# EAGLE design WIXIE (EAGLE 9.6.2)
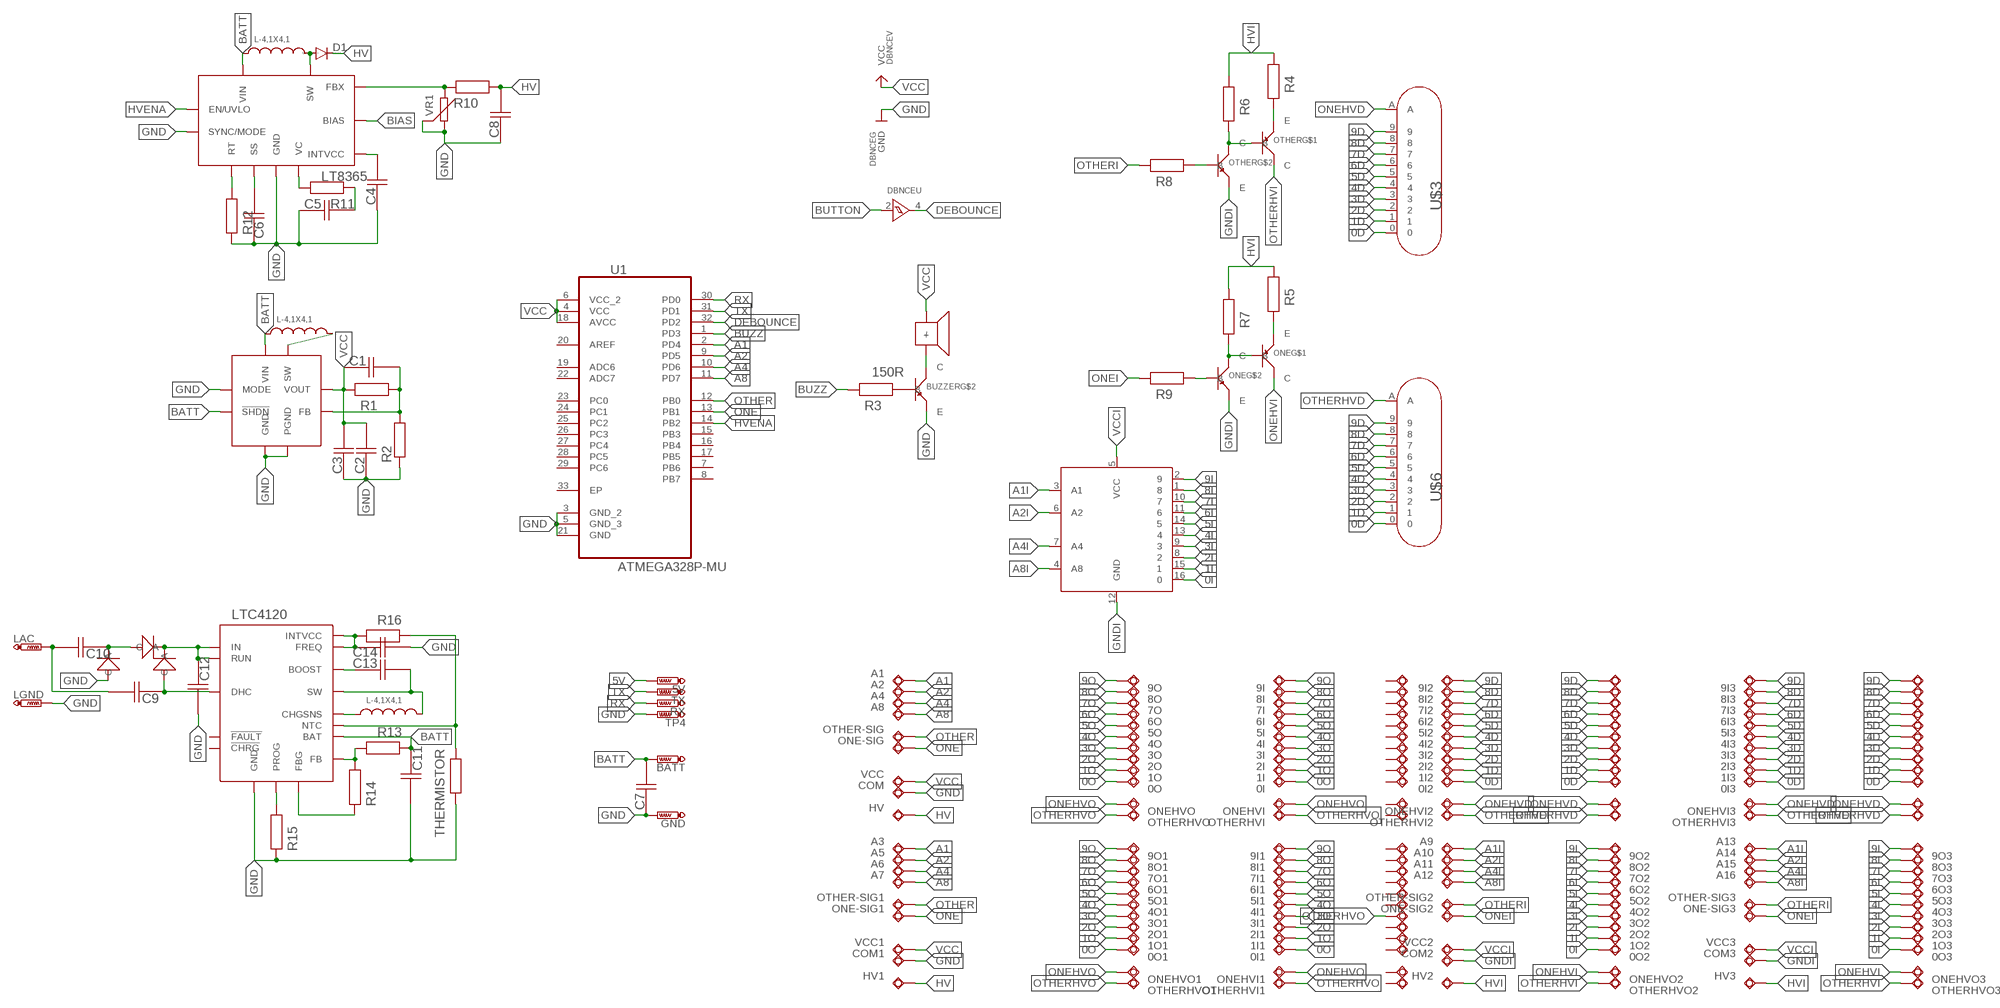
[diagram p0: schematic, sheet 1]

## Parts
0I  TPSQTP12SQ  [TP12SQ]
0I1  TPSQTP12SQ  [TP12SQ]
0I2  TPSQTP12SQ  [TP12SQ]
0I3  TPSQTP12SQ  [TP12SQ]
0O  TPSQTP12SQ  [TP12SQ]
0O1  TPSQTP12SQ  [TP12SQ]
0O2  TPSQTP12SQ  [TP12SQ]
0O3  TPSQTP12SQ  [TP12SQ]
1I  TPSQTP12SQ  [TP12SQ]
1I1  TPSQTP12SQ  [TP12SQ]
1I2  TPSQTP12SQ  [TP12SQ]
1I3  TPSQTP12SQ  [TP12SQ]
1O  TPSQTP12SQ  [TP12SQ]
1O1  TPSQTP12SQ  [TP12SQ]
1O2  TPSQTP12SQ  [TP12SQ]
1O3  TPSQTP12SQ  [TP12SQ]
2I  TPSQTP12SQ  [TP12SQ]
2I1  TPSQTP12SQ  [TP12SQ]
2I2  TPSQTP12SQ  [TP12SQ]
2I3  TPSQTP12SQ  [TP12SQ]
2O  TPSQTP12SQ  [TP12SQ]
2O1  TPSQTP12SQ  [TP12SQ]
2O2  TPSQTP12SQ  [TP12SQ]
2O3  TPSQTP12SQ  [TP12SQ]
3I  TPSQTP12SQ  [TP12SQ]
3I1  TPSQTP12SQ  [TP12SQ]
3I2  TPSQTP12SQ  [TP12SQ]
3I3  TPSQTP12SQ  [TP12SQ]
3O  TPSQTP12SQ  [TP12SQ]
3O1  TPSQTP12SQ  [TP12SQ]
3O2  TPSQTP12SQ  [TP12SQ]
3O3  TPSQTP12SQ  [TP12SQ]
4I  TPSQTP12SQ  [TP12SQ]
4I1  TPSQTP12SQ  [TP12SQ]
4I2  TPSQTP12SQ  [TP12SQ]
4I3  TPSQTP12SQ  [TP12SQ]
4O  TPSQTP12SQ  [TP12SQ]
4O1  TPSQTP12SQ  [TP12SQ]
4O2  TPSQTP12SQ  [TP12SQ]
4O3  TPSQTP12SQ  [TP12SQ]
5I  TPSQTP12SQ  [TP12SQ]
5I1  TPSQTP12SQ  [TP12SQ]
5I2  TPSQTP12SQ  [TP12SQ]
5I3  TPSQTP12SQ  [TP12SQ]
5O  TPSQTP12SQ  [TP12SQ]
5O1  TPSQTP12SQ  [TP12SQ]
5O2  TPSQTP12SQ  [TP12SQ]
5O3  TPSQTP12SQ  [TP12SQ]
5V  PTR1B1,27  [B1,27]
6I  TPSQTP12SQ  [TP12SQ]
6I1  TPSQTP12SQ  [TP12SQ]
6I2  TPSQTP12SQ  [TP12SQ]
6I3  TPSQTP12SQ  [TP12SQ]
6O  TPSQTP12SQ  [TP12SQ]
6O1  TPSQTP12SQ  [TP12SQ]
6O2  TPSQTP12SQ  [TP12SQ]
6O3  TPSQTP12SQ  [TP12SQ]
7I  TPSQTP12SQ  [TP12SQ]
7I1  TPSQTP12SQ  [TP12SQ]
7I2  TPSQTP12SQ  [TP12SQ]
7I3  TPSQTP12SQ  [TP12SQ]
7O  TPSQTP12SQ  [TP12SQ]
7O1  TPSQTP12SQ  [TP12SQ]
7O2  TPSQTP12SQ  [TP12SQ]
7O3  TPSQTP12SQ  [TP12SQ]
8I  TPSQTP12SQ  [TP12SQ]
8I1  TPSQTP12SQ  [TP12SQ]
8I2  TPSQTP12SQ  [TP12SQ]
8I3  TPSQTP12SQ  [TP12SQ]
8O  TPSQTP12SQ  [TP12SQ]
8O1  TPSQTP12SQ  [TP12SQ]
8O2  TPSQTP12SQ  [TP12SQ]
8O3  TPSQTP12SQ  [TP12SQ]
9I  TPSQTP12SQ  [TP12SQ]
9I1  TPSQTP12SQ  [TP12SQ]
9I2  TPSQTP12SQ  [TP12SQ]
9I3  TPSQTP12SQ  [TP12SQ]
9O  TPSQTP12SQ  [TP12SQ]
9O1  TPSQTP12SQ  [TP12SQ]
9O2  TPSQTP12SQ  [TP12SQ]
9O3  TPSQTP12SQ  [TP12SQ]
A1  TPSQTP12SQ  [TP12SQ]
A2  TPSQTP12SQ  [TP12SQ]
A3  TPSQTP12SQ  [TP12SQ]
A4  TPSQTP12SQ  [TP12SQ]
A5  TPSQTP12SQ  [TP12SQ]
A6  TPSQTP12SQ  [TP12SQ]
A7  TPSQTP12SQ  [TP12SQ]
A8  TPSQTP12SQ  [TP12SQ]
A9  TPSQTP12SQ  [TP12SQ]
A10  TPSQTP12SQ  [TP12SQ]
A11  TPSQTP12SQ  [TP12SQ]
A12  TPSQTP12SQ  [TP12SQ]
A13  TPSQTP12SQ  [TP12SQ]
A14  TPSQTP12SQ  [TP12SQ]
A15  TPSQTP12SQ  [TP12SQ]
A16  TPSQTP12SQ  [TP12SQ]
BATT  PTR1PAD1-13  [P1-13]
BUZZER  MMDT5451  [SOT-363]
C1  CAPACITOR-0603  [0603]
C2  CAPACITOR-0603  [0603]
C3  CAPACITOR-0603  [0603]
C4  CAPACITOR-0603  [0603]
C5  CAPACITOR-0603  [0603]
C6  CAPACITOR-0603  [0603]
C7  CAPACITOR-0603  [0603]
C8  CAPACITOR-0603  [0603]
C9  CAPACITOR-0603  [0603]
C10  CAPACITOR-0603  [0603]
C11  CAPACITOR-0603  [0603]
C12  CAPACITOR-0603  [0603]
C13  CAPACITOR-0603  [0603]
C14  CAPACITOR-0603  [0603]
COM  TPSQTP12SQ  [TP12SQ]
COM1  TPSQTP12SQ  [TP12SQ]
COM2  TPSQTP12SQ  [TP12SQ]
COM3  TPSQTP12SQ  [TP12SQ]
D1  DIODE-SOD123  [SOD123]
DBNCE  74AHC1G17  [SOT-353-1]
GND  PTR1PAD1-13  [P1-13]
HV  TPSQTP12SQ  [TP12SQ]
HV1  TPSQTP12SQ  [TP12SQ]
HV2  TPSQTP12SQ  [TP12SQ]
HV3  TPSQTP12SQ  [TP12SQ]
LAC  PTR1PAD1-13  [P1-13]
LGND  PTR1PAD1-13  [P1-13]
LT8365  LT8365  [MSE16]
LTC3539  LTC3539  [DFN8-2X3]
LTC4120  LTC4120  [QFN16]
ONE  MMDT5451  [SOT-363]
ONE-SIG  TPSQTP12SQ  [TP12SQ]
ONE-SIG1  TPSQTP12SQ  [TP12SQ]
ONE-SIG2  TPSQTP12SQ  [TP12SQ]
ONE-SIG3  TPSQTP12SQ  [TP12SQ]
ONEHVI  TPSQTP12SQ  [TP12SQ]
ONEHVI1  TPSQTP12SQ  [TP12SQ]
ONEHVI2  TPSQTP12SQ  [TP12SQ]
ONEHVI3  TPSQTP12SQ  [TP12SQ]
ONEHVO  TPSQTP12SQ  [TP12SQ]
ONEHVO1  TPSQTP12SQ  [TP12SQ]
ONEHVO2  TPSQTP12SQ  [TP12SQ]
ONEHVO3  TPSQTP12SQ  [TP12SQ]
OTHER  MMDT5451  [SOT-363]
OTHER-SIG  TPSQTP12SQ  [TP12SQ]
OTHER-SIG1  TPSQTP12SQ  [TP12SQ]
OTHER-SIG2  TPSQTP12SQ  [TP12SQ]
OTHER-SIG3  TPSQTP12SQ  [TP12SQ]
OTHERHVI  TPSQTP12SQ  [TP12SQ]
OTHERHVI1  TPSQTP12SQ  [TP12SQ]
OTHERHVI2  TPSQTP12SQ  [TP12SQ]
OTHERHVI3  TPSQTP12SQ  [TP12SQ]
OTHERHVO  TPSQTP12SQ  [TP12SQ]
OTHERHVO1  TPSQTP12SQ  [TP12SQ]
OTHERHVO2  TPSQTP12SQ  [TP12SQ]
OTHERHVO3  TPSQTP12SQ  [TP12SQ]
R1  RESISTOR-0603  [0603]
R2  RESISTOR-0603  [0603]
R3  150R  RESISTOR-0603  [0603]
R4  RESISTOR-0603  [0603]
R5  RESISTOR-0603  [0603]
R6  RESISTOR-0603  [0603]
R7  RESISTOR-0603  [0603]
R8  RESISTOR-0603  [0603]
R9  RESISTOR-0603  [0603]
R10  RESISTOR-0603  [0603]
R11  RESISTOR-0603  [0603]
R12  RESISTOR-0603  [0603]
R13  RESISTOR-0603  [0603]
R14  RESISTOR-0603  [0603]
R15  RESISTOR-0603  [0603]
R16  RESISTOR-0603  [0603]
RX  PTR1B1,27  [B1,27]
THERMISTOR  RESISTOR-0603  [0603]
TP1  TPSQTP12SQ  [TP12SQ]
TP2  TPSQTP12SQ  [TP12SQ]
TP3  TPSQTP12SQ  [TP12SQ]
TP4  PTR1B1,27  [B1,27]
TP5  TPSQTP12SQ  [TP12SQ]
TP6  TPSQTP12SQ  [TP12SQ]
TP7  TPSQTP12SQ  [TP12SQ]
TP8  TPSQTP12SQ  [TP12SQ]
TP9  TPSQTP12SQ  [TP12SQ]
TP10  TPSQTP12SQ  [TP12SQ]
TP11  TPSQTP12SQ  [TP12SQ]
TP12  TPSQTP12SQ  [TP12SQ]
TP13  TPSQTP12SQ  [TP12SQ]
TP14  TPSQTP12SQ  [TP12SQ]
TP15  TPSQTP12SQ  [TP12SQ]
TP16  TPSQTP12SQ  [TP12SQ]
TP17  TPSQTP12SQ  [TP12SQ]
TP18  TPSQTP12SQ  [TP12SQ]
TP19  TPSQTP12SQ  [TP12SQ]
TP20  TPSQTP12SQ  [TP12SQ]
TP21  TPSQTP12SQ  [TP12SQ]
TP22  TPSQTP12SQ  [TP12SQ]
TP23  TPSQTP12SQ  [TP12SQ]
TP24  TPSQTP12SQ  [TP12SQ]
TP25  TPSQTP12SQ  [TP12SQ]
TP26  TPSQTP12SQ  [TP12SQ]
TP27  TPSQTP12SQ  [TP12SQ]
TP28  TPSQTP12SQ  [TP12SQ]
TP29  TPSQTP12SQ  [TP12SQ]
TP30  TPSQTP12SQ  [TP12SQ]
TP31  TPSQTP12SQ  [TP12SQ]
TP32  TPSQTP12SQ  [TP12SQ]
TP33  TPSQTP12SQ  [TP12SQ]
TP34  TPSQTP12SQ  [TP12SQ]
TP35  TPSQTP12SQ  [TP12SQ]
TP36  TPSQTP12SQ  [TP12SQ]
TP37  TPSQTP12SQ  [TP12SQ]
TP38  TPSQTP12SQ  [TP12SQ]
TP39  TPSQTP12SQ  [TP12SQ]
TP40  TPSQTP12SQ  [TP12SQ]
TP41  TPSQTP12SQ  [TP12SQ]
TP42  TPSQTP12SQ  [TP12SQ]
TP43  TPSQTP12SQ  [TP12SQ]
TP44  TPSQTP12SQ  [TP12SQ]
TP45  TPSQTP12SQ  [TP12SQ]
TP46  TPSQTP12SQ  [TP12SQ]
TP47  TPSQTP12SQ  [TP12SQ]
TP48  TPSQTP12SQ  [TP12SQ]
TP49  TPSQTP12SQ  [TP12SQ]
TX  PTR1B1,27  [B1,27]
U1  ATMEGA328P-MU  [QFN50P500X500X100-33N]
U$2  BUZZ-8.5X8.5  [BUZZ-8.5X8.5]
U$3  IN-17  [IN-17]
U$5  ZENER0603  [0603DIODE]
U$6  IN-17  [IN-17]
U$7  L-4,1X4,1  [L-4.1X4.1]
U$8  L-4,1X4,1  [L-4.1X4.1]
U$9  K133ID1  [K133ID1]
U$10  L-4,1X4,1  [L-4.1X4.1]
U$11  ZENER0603  [0603DIODE]
U$12  ZENER0603  [0603DIODE]
VCC  TPSQTP12SQ  [TP12SQ]
VCC1  TPSQTP12SQ  [TP12SQ]
VCC2  TPSQTP12SQ  [TP12SQ]
VCC3  TPSQTP12SQ  [TP12SQ]
VR1  SR3305  [SR3305]

## Nets
0D: 0I2.TP 0I3.TP TP23.TP TP47.TP U$3.0 U$6.0
0I: 0O2.TP 0O3.TP U$9.16
0O: 0I1.TP 0I.TP 0O1.TP 0O.TP
1D: 1I2.TP 1I3.TP TP22.TP TP34.TP U$3.1 U$6.1
1I: 1O2.TP 1O3.TP U$9.15
1O: 1I1.TP 1I.TP 1O1.TP 1O.TP
2D: 2I2.TP 2I3.TP TP21.TP TP33.TP U$3.2 U$6.2
2I: 2O2.TP 2O3.TP U$9.8
2O: 2I1.TP 2I.TP 2O1.TP 2O.TP
3D: 3I2.TP 3I3.TP TP20.TP TP32.TP U$3.3 U$6.3
3I: 3O2.TP 3O3.TP U$9.9
3O: 3I1.TP 3I.TP 3O1.TP 3O.TP
4D: 4I2.TP 4I3.TP TP19.TP TP31.TP U$3.4 U$6.4
4I: 4O2.TP 4O3.TP U$9.13
4O: 4I1.TP 4I.TP 4O1.TP 4O.TP
5D: 5I2.TP 5I3.TP TP18.TP TP30.TP U$3.5 U$6.5
5I: 5O2.TP 5O3.TP U$9.14
5O: 5I1.TP 5I.TP 5O1.TP 5O.TP
5V: 5V.TP
6D: 6I2.TP 6I3.TP TP17.TP TP29.TP U$3.6 U$6.6
6I: 6O2.TP 6O3.TP U$9.11
6O: 6I1.TP 6I.TP 6O1.TP 6O.TP
7D: 7I2.TP 7I3.TP TP16.TP TP28.TP U$3.7 U$6.7
7I: 7O2.TP 7O3.TP U$9.10
7O: 7I1.TP 7I.TP 7O1.TP 7O.TP
8D: 8I2.TP 8I3.TP TP15.TP TP27.TP U$3.8 U$6.8
8I: 8O2.TP 8O3.TP U$9.1
8O: 8I1.TP 8I.TP 8O1.TP 8O.TP
9D: 9I2.TP 9I3.TP TP14.TP TP26.TP U$3.9 U$6.9
9I: 9O2.TP 9O3.TP U$9.2
9O: 9I1.TP 9I.TP 9O1.TP 9O.TP
A1: A1.TP A3.TP U1.2(PD4)
A1I: A9.TP A13.TP U$9.3(A1)
A2: A2.TP A5.TP U1.9(PD5)
A2I: A10.TP A14.TP U$9.6(A2)
A4: A4.TP A6.TP U1.10(PD6)
A4I: A11.TP A15.TP U$9.7(A4)
A8: A7.TP A8.TP U1.11(PD7)
A8I: A12.TP A16.TP U$9.4(A8)
BATT: BATT.TP C7.2 C11.1 LT8365.3(VIN) LTC3539.4(VIN) LTC3539.5(!SHDN) LTC4120.09(BAT) R13.1 U$8.P$1 U$10.P$1
BIAS: LT8365.7(BIAS)
BUTTON: DBNCE.2(U:A)
BUZZ: R3.1 U1.1(PD3)
DEBOUNCE: DBNCE.4(U:Y) U1.32(PD2)
GND: BUZZER.1(E) C2.1 C3.1 C4.1 C5.1 C6.1 C7.1 C8.1 C11.2 C12.2 C14.2 COM1.TP COM.TP DBNCE.3(G:GND) GND.TP LGND.TP LT8365.12(SYNC/MODE) LT8365.PAD(GND) LTC3539.2(PGND) LTC3539.3(GND) LTC3539.7(MODE) LTC3539.PAD(GND) LTC4120.05(GND) R2.1 R12.1 R15.1 THERMISTOR.2 TP4.TP U1.3(GND_2) U1.5(GND_3) U1.21(GND) U$12.POS(A) VR1.2 VR1.3
GNDI: COM2.TP COM3.TP ONE.1(E) OTHER.1(E) U$9.12(GND)
HV [HV]: C8.2 D1.C HV1.TP HV.TP R10.2
HVENA: LT8365.1(EN/UVLO) U1.14(PB2)
HVI [HV]: HV2.TP HV3.TP R4.2 R5.2 R6.2 R7.2
N22: C1.2 LTC3539.6(FB) R1.2 R2.2
N$1: BUZZER.6(C) U$2.-
N$2: LTC3539.1(SW) U$10.P$2
N$5: OTHER.4(E) R4.1
N$6: BUZZER.2(B) R3.2
N$7: C4.2 LT8365.5(INTVCC)
N$8: OTHER.5(B) OTHER.6(C) R6.1
N$10: C5.2 R11.2
N$11: OTHER.2(B) R8.2
N$12: D1.A LT8365.14(SW) LT8365.16(SW) U$8.P$2
N$13: LT8365.9(FBX) R10.1 VR1.1
N$14: C10.1 U$5.POS(A) U$12.NEG(C)
N$15: C9.2 C10.2 LAC.TP
N$16: LT8365.8(VC) R11.1
N$18: C6.2 LT8365.11(SS)
N$19: LT8365.10(RT) R12.2
N$21: C12.1 LTC4120.03(IN) LTC4120.16(RUN) U$5.NEG(C) U$11.NEG(C)
N$22: C9.1 LTC4120.06(DHC) U$11.POS(A)
N$26: LTC4120.13(PROG) R15.2
N$27: LTC4120.11(FBG) R14.1
N$28: LTC4120.10(FB) R13.2 R14.2
N$30: LTC4120.12(NTC) R16.1 THERMISTOR.1
N$31: LTC4120.08(CHGSNS) U$7.P$1
N$32: C13.2 LTC4120.04(SW) U$7.P$2
N$33: C13.1 LTC4120.02(BOOST)
N$34: C14.1 LTC4120.01(INTVCC) LTC4120.07(FREQ) R16.2
N$38: ONE.2(B) R9.2
N$41: ONE.4(E) R5.1
N$42: ONE.5(B) ONE.6(C) R7.1
ONE: ONE-SIG1.TP ONE-SIG.TP U1.13(PB1)
ONEHVD [HV]: ONEHVI2.TP ONEHVI3.TP TP24.TP TP48.TP U$3.A
ONEHVI [HV]: ONE.3(C) ONEHVO2.TP ONEHVO3.TP
ONEHVO [HV]: ONEHVI1.TP ONEHVI.TP ONEHVO1.TP ONEHVO.TP
ONEI: ONE-SIG2.TP ONE-SIG3.TP R9.1
OTHER: OTHER-SIG1.TP OTHER-SIG.TP U1.12(PB0)
OTHERHVD [HV]: OTHERHVI2.TP OTHERHVI3.TP TP25.TP TP49.TP U$6.A
OTHERHVI [HV]: OTHER.3(C) OTHERHVO2.TP OTHERHVO3.TP
OTHERHVO [HV]: OTHERHVI1.TP OTHERHVI.TP OTHERHVO1.TP OTHERHVO.TP TP8.TP
OTHERI: OTHER-SIG2.TP OTHER-SIG3.TP R8.1
RX: RX.TP U1.30(PD0)
TX: TX.TP U1.31(PD1)
VCC: C1.1 C2.2 C3.2 DBNCE.5(V:VCC) LTC3539.8(VOUT) R1.1 U1.4(VCC) U1.6(VCC_2) U1.18(AVCC) U$2.+ VCC1.TP VCC.TP
VCCI: U$9.5(VCC) VCC2.TP VCC3.TP
Unconnected: BUZZER.3(C) BUZZER.4(E) BUZZER.5(B) LTC4120.14(!CHRG) LTC4120.15(!FAULT) TP1.TP TP2.TP TP3.TP TP5.TP TP6.TP TP7.TP TP9.TP TP10.TP TP11.TP TP12.TP TP13.TP TP35.TP TP36.TP TP37.TP TP38.TP TP39.TP TP40.TP TP41.TP TP42.TP TP43.TP TP44.TP TP45.TP TP46.TP U1.7(PB6) U1.8(PB7) U1.15(PB3) U1.16(PB4) U1.17(PB5) U1.19(ADC6) U1.20(AREF) U1.22(ADC7) U1.23(PC0) U1.24(PC1) U1.25(PC2) U1.26(PC3) U1.27(PC4) U1.28(PC5) U1.29(PC6) U1.33(EP)

## Library data of the parts
0I 0I1-0I3 0O 0O1-0O3 1I 1I1-1I3 1O 1O1-1O3 2I 2I1-2I3 2O 2O1-2O3 3I 3I1-3I3 3O 3O1-3O3 4I 4I1-4I3 4O 4O1-4O3 5I 5I1-5I3 5O 5O1-5O3 6I 6I1-6I3 6O 6O1-6O3 7I 7I1-7I3 7O 7O1-7O3 8I 8I1-8I3 8O 8O1-8O3 9I 9I1-9I3 9O 9O1-9O3 A1-A16 COM COM1-COM3 HV HV1-HV3 ONE-SIG ONE-SIG1-ONE-SIG3 ONEHVI ONEHVI1-ONEHVI3 ONEHVO ONEHVO1-ONEHVO3 OTHER-SIG OTHER-SIG1-OTHER-SIG3 OTHERHVI OTHERHVI1-OTHERHVI3 OTHERHVO OTHERHVO1-OTHERHVO3 TP1-TP3 TP5-TP49 VCC VCC1-VCC3 = testpad:TPSQ: Test pad
5V BATT GND LAC LGND RX TP4 TX = testpad:PTR1: TEST PIN
BUZZER ONE OTHER = MY liB:MMDT5451
C1-C14 = MY liB:CAPACITOR-0603
D1 = diode:DIODE-: DIODE
DBNCE = MY liB:74AHC1G17
LT8365 = MY liB:LT8365
LTC3539 = MY liB:LTC3539
LTC4120 = MY liB:LTC4120
R1-R16 THERMISTOR = MY liB:RESISTOR-0603
U1 = Atmel_By_element14_Batch_1-00:ATMEGA328P-MU: Programmable Flash; MPN: ATMEGA328P-MU; OC_FARNELL: 1748522; OC_NEWARK: 26R2526; PACKAGE: QFN-32; SUPPLIER: Atmel
U$2 = MY liB:BUZZ-8.5X8.5
U$3 U$6 = MY liB:IN-17
U$5 U$11 U$12 = MY liB:ZENER0603
U$7 U$8 U$10 = MY liB:L-4,1X4,1
U$9 = MY liB:K133ID1
VR1 = MY liB:SR3305

## Net classes
1 HV: clearance 0.508 mm

## Board
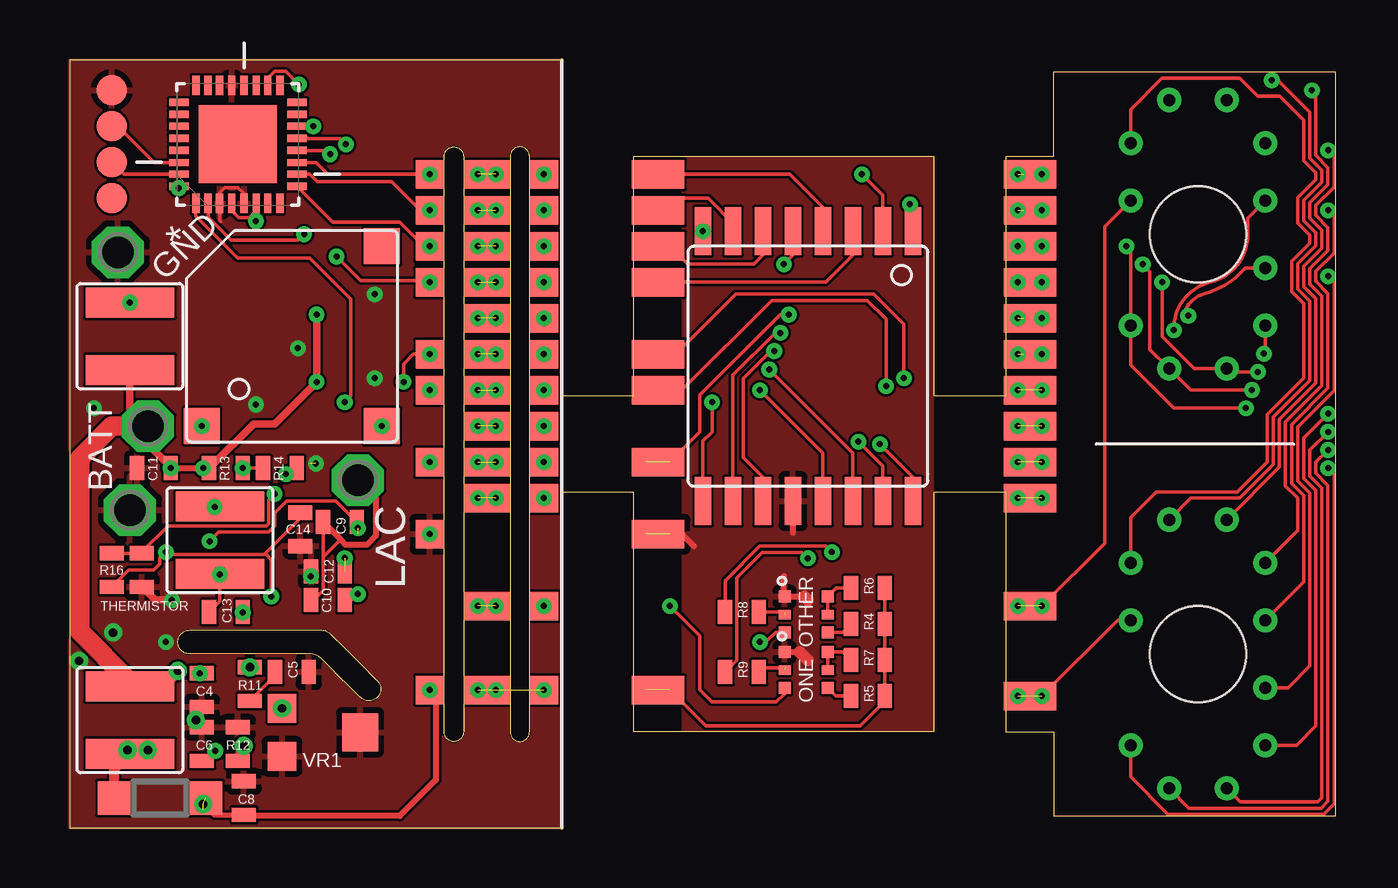
[diagram p1: board, top side]
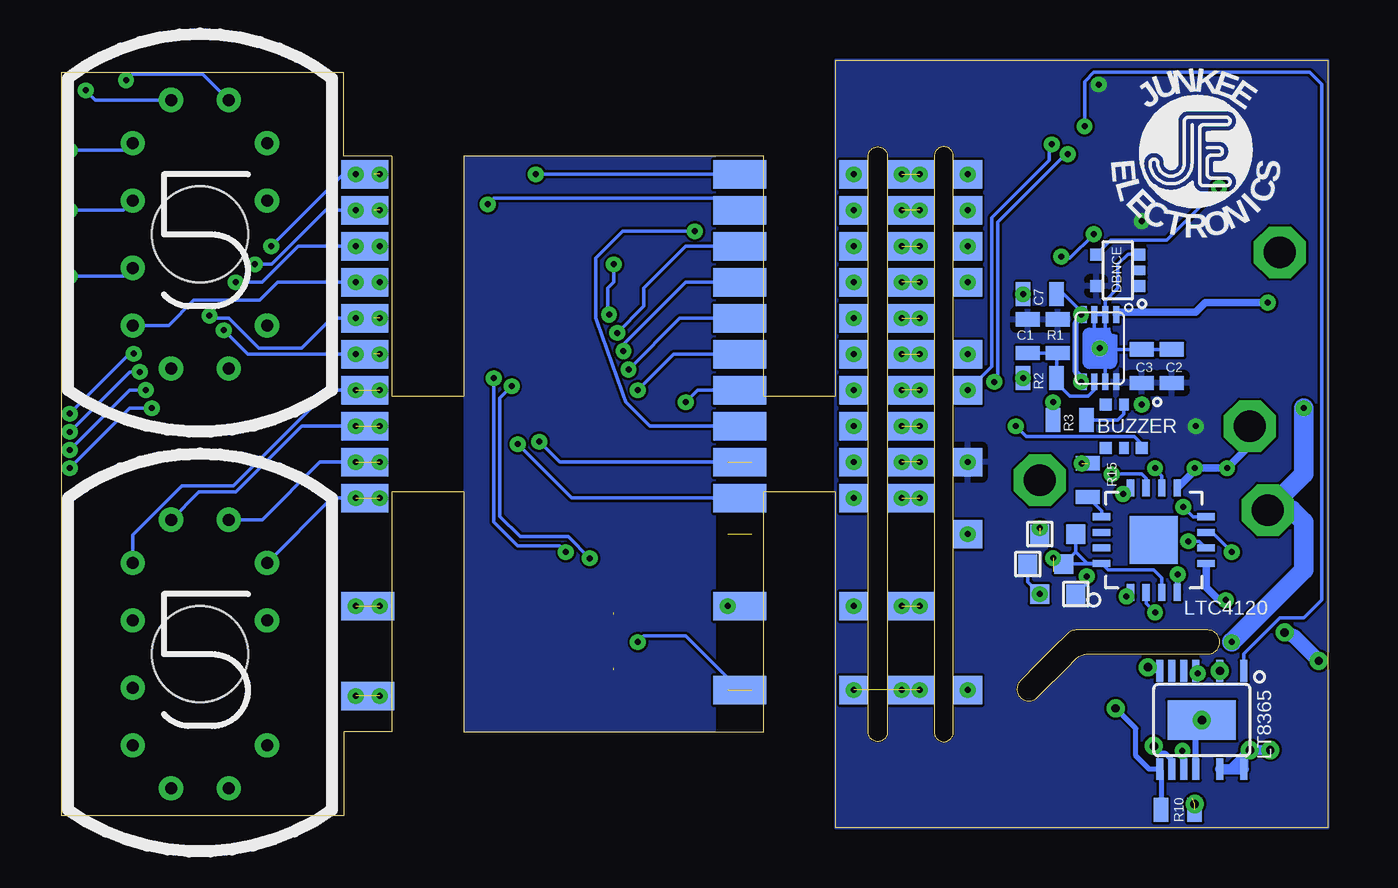
[diagram p2: board, bottom side, seen from below]

Size 52.75 x 32 mm. Coordinates in mm from the lower left corner, seen from the top.
Outline: 0,0 20.5,0 20.5,14 23.5,14 23.5,4 36,4 36,14 39,14 39,4 41,4 41,0.5 52.75,0.5 52.75,31.5 41,31.5 41,28 39,28 39,18 36,18 36,28 23.5,28 23.5,18 20.5,18 20.5,32 0,32 0,0
Outline: 15.6,4 15.6,28 arc-180 16.4,28 16.4,4 arc-180 15.6,4
Outline: 18.35,28 18.35,4 arc180 19.15,4 19.15,28 arc180 18.35,28
Outline: 5,8.25 10.5,8.25 arc-46 10.85,8.1 arc-3 12.75,6.2 arc3 12.8,6.15 arc-183 12.1,5.45 arc3 11.6,5.95 arc-3 10.5,7.05 arc49 10,7.25 5,7.25 arc-180 5,8.25
Copper layers (1*16): Top 0.035mm / dielectric 1.5mm / Bottom 0.035mm
Design rules "default *": minimum track width 6mil, minimum drill 0.25mm, track to track 4mil, track to pad 4mil, pad to pad 4mil, via to via 4mil, smd to smd 4mil, copper to edge 0mil, drill to drill 6mil, minimum pad ring 10mil, minimum via ring 8mil, stop-mask expansion 4mil, vias tented up to drill 25mil, thermal gap 10mil

### Footprints (pad centres in the part's own frame; a part is rotated, then mirrored left to right if it is on the bottom)
TP12SQ = smd 1.2 x 1.2: TP 0,0
B1,27 = smd 1.27 x 1.27: TP 0,0
P1-13 = drill 1.321 pad 2.159 octagon: TP 0,0
SOT-363 = smd 0.5 x 0.5: 1 0.75,0.9; 3 -0.75,0.9; 4 -0.75,-0.9; 6 0.75,-0.9 | smd 0.4 x 0.5: 2 0,0.9; 5 0,-0.9
0603 = smd 1 x 0.6: 1 0,-0.7; 2 0,0.7
SOD123 = smd 1.4 x 1.4: A 1.9,0; C -1.9,0
SOT-353-1 = smd 0.5 x 0.5: 1 0.65,0.9; 3 -0.65,0.9; 4 -0.65,-0.9; 5 0.65,-0.9 | smd 0.4 x 0.5: 2 0,0.9
MSE16 = smd 0.3 x 0.9: 1 -1.75,-2.05; 3 -0.75,-2.05; 5 0.25,-2.05; 6 0.75,-2.05; 7 1.25,-2.05; 8 1.75,-2.05; 9 1.75,2.05; 10 1.25,2.05; 11 0.75,2.05; 12 0.25,2.05; 14 -0.75,2.05; 16 -1.75,2.05 | smd 2.845 x 1.65: PAD 0,0
DFN8-2X3 = smd 0.25 x 0.7: 1 -0.675,-1.4; 2 -0.225,-1.4; 3 0.225,-1.4; 4 0.675,-1.4; 5 0.675,1.4; 6 0.225,1.4; 7 -0.225,1.4; 8 -0.675,1.4; PAD 0,0
QFN16 = smd 0.72 x 0.3: 01 -2.175,0.975; 02 -2.175,0.325; 03 -2.175,-0.325; 04 -2.175,-0.975; 09 2.175,-0.975; 10 2.175,-0.325; 11 2.175,0.325; 12 2.175,0.975 | smd 0.3 x 0.72: 05 -0.975,-2.175; 06 -0.325,-2.175; 07 0.325,-2.175; 08 0.975,-2.175; 13 0.975,2.175; 14 0.325,2.175; 15 -0.325,2.175; 16 -0.975,2.175 | smd 2 x 2: PAD 0,0
QFN50P500X500X100-33N = smd 0.813 x 0.305: 1 -2.464,1.753; 2 -2.464,1.245; 3 -2.464,0.762; 4 -2.464,0.254; 5 -2.464,-0.254; 6 -2.464,-0.762; 7 -2.464,-1.245; 8 -2.464,-1.753; 17 2.464,-1.753; 18 2.464,-1.245; 19 2.464,-0.762; 20 2.464,-0.254; 21 2.464,0.254; 22 2.464,0.762; 23 2.464,1.245; 24 2.464,1.753 | smd 0.305 x 0.813: 9 -1.753,-2.464; 10 -1.245,-2.464; 11 -0.762,-2.464; 12 -0.254,-2.464; 13 0.254,-2.464; 14 0.762,-2.464; 15 1.245,-2.464; 16 1.753,-2.464; 25 1.753,2.464; 26 1.245,2.464; 27 0.762,2.464; 28 0.254,2.464; 29 -0.254,2.464; 30 -0.762,2.464; 31 -1.245,2.464; 32 -1.753,2.464 | smd 3.251 x 3.251: 33 0,0
BUZZ-8.5X8.5 = smd 1.5 x 1.5: + -3.75,3.75; - -3.75,-3.75; DUMMY 3.75,-3.75
IN-17 = drill 0.5: 0 -3.8,2.8; 1 -5.6,1.2; 2 -5.6,-1.2; 3 -3.8,-2.8; 4 -1.4,-2.8; 5 1.4,-2.8; 6 3.8,-2.8; 7 5.6,-1.2; 8 5.6,1.2; 9 3.8,2.8; A -1.4,2.8 | hole 4: 0,0
0603DIODE = smd 0.8 x 0.8: NEG 0,0.75; POS 0,-0.75
L-4.1X4.1 = smd 1.25 x 3.7: P$1 1.4,0; P$2 -1.4,0
K133ID1 = smd 0.7 x 2: 1 -4.375,-5.625; 2 -3.125,-5.625; 3 -1.875,-5.625; 4 -0.625,-5.625; 5 0.625,-5.625; 6 1.875,-5.625; 7 3.125,-5.625; 8 4.375,-5.625; 9 4.375,5.625; 10 3.125,5.625; 11 1.875,5.625; 12 0.625,5.625; 13 -0.625,5.625; 14 -1.875,5.625; 15 -3.125,5.625; 16 -4.375,5.625
SR3305 = smd 1.2 x 1.2: 1 -1,-1.8; 3 1,-1.8 | smd 1.6 x 1.5: 2 0,1.45

### Placement (x,y rotation side)
0I  17.75,13.75 0 top
0I1  17.75,13.75 0 bottom
0I2  40.5,13.75 0 top
0I3  39.5,13.75 0 top
0O  17,13.75 0 top
0O1  17,13.75 0 bottom
0O2  25,13.75 0 bottom
0O3  24,13.75 0 bottom
1I  17.75,15.25 0 top
1I1  17,15.25 0 bottom
1I2  39.5,15.25 0 top
1I3  40.5,15.25 0 top
1O  17,15.25 0 top
1O1  17.75,15.25 0 bottom
1O2  25,15.25 0 bottom
1O3  24,15.25 0 bottom
2I  17.75,16.75 0 top
2I1  17,16.75 0 bottom
2I2  40.5,16.75 0 top
2I3  39.5,16.75 0 top
2O  17,16.75 0 top
2O1  17.75,16.75 0 bottom
2O2  25,16.75 0 bottom
2O3  24,16.75 0 bottom
3I  17.75,18.25 0 top
3I1  17.75,18.25 0 bottom
3I2  40.5,18.25 0 top
3I3  39.5,18.25 0 top
3O  17,18.25 0 top
3O1  17,18.25 0 bottom
3O2  25,18.25 0 bottom
3O3  24,18.25 0 bottom
4I  17.75,19.75 0 top
4I1  17.75,19.75 0 bottom
4I2  40.5,19.75 0 top
4I3  39.5,19.75 0 top
4O  17,19.75 0 top
4O1  17,19.75 0 bottom
4O2  25,19.75 0 bottom
4O3  24,19.75 0 bottom
5I  17.75,21.25 0 top
5I1  17.75,21.25 0 bottom
5I2  40.5,21.25 0 top
5I3  39.5,21.25 0 top
5O  17,21.25 0 top
5O1  17,21.25 0 bottom
5O2  25,21.25 0 bottom
5O3  24,21.25 0 bottom
5V  1.75,26.25 90 top
6I  17.75,22.75 0 top
6I1  17.75,22.75 0 bottom
6I2  39.5,22.75 0 top
6I3  40.5,22.75 0 top
6O  17,22.75 0 top
6O1  17,22.75 0 bottom
6O2  25,22.75 0 bottom
6O3  24,22.75 0 bottom
7I  17.75,24.25 0 top
7I1  17.75,24.25 0 bottom
7I2  40.5,24.25 0 top
7I3  39.5,24.25 0 top
7O  17,24.25 0 top
7O1  17,24.25 0 bottom
7O2  25,24.25 0 bottom
7O3  24,24.25 0 bottom
8I  17.75,25.75 0 top
8I1  17,25.75 0 bottom
8I2  40.5,25.75 0 top
8I3  39.5,25.75 0 top
8O  17,25.75 0 top
8O1  17.75,25.75 0 bottom
8O2  25,25.75 0 bottom
8O3  24,25.75 0 bottom
9I  17.75,27.25 0 top
9I1  17.75,27.25 0 bottom
9I2  40.5,27.25 0 top
9I3  39.5,27.25 0 top
9O  17,27.25 0 top
9O1  17,27.25 0 bottom
9O2  25,27.25 0 bottom
9O3  24,27.25 0 bottom
A1  15,22.75 0 top
A2  15,24.25 0 top
A3  15,22.75 0 bottom
A4  15,25.75 0 top
A5  15,24.25 0 bottom
A6  15,25.75 0 bottom
A7  15,27.25 0 bottom
A8  15,27.25 0 top
A9  25,22.75 0 top
A10  25,24.25 0 top
A11  25,25.75 0 top
A12  25,27.25 0 top
A13  24,22.75 0 top
A14  24,24.25 0 top
A15  24,25.75 0 top
A16  24,27.25 0 top
BATT  3.25,16.75 0 top
BUZZER  8.5,16.75 0 bottom
C1  12.5,20.5 180 bottom
C2  6.5,19.25 180 bottom
C3  7.75,19.25 180 bottom
C4  5.5,5.75 0 top
C5  9.25,6.5 90 top
C6  5.5,3.5 180 top
C7  12,22.25 270 bottom
C8  7.25,1.25 180 top
C9  11.25,12.75 90 top
C10  10.75,9.5 90 top
C11  3.5,15 90 top
C12  10.75,10.7 90 top
C13  6.5,9 90 top
C14  9.6,12.45 180 top
COM  15,12.25 0 top
COM1  15,12.25 0 bottom
COM2  25,12.25 0 top
COM3  24,12.25 0 top
D1  3.75,1.25 180 top
DBNCE  8.75,23.25 270 bottom
GND  2,24 0 top
HV  15,5.75 0 top
HV1  15,5.75 0 bottom
HV2  25,5.75 0 top
HV3  24,5.75 0 top
LAC  12,14.5 270 top
LGND  2.5,13.25 270 top
LT8365  5.25,4.5 180 bottom
LTC3539  9.5,20 180 bottom
LTC4120  7.25,12 90 bottom
ONE  30.68,6.59 90 top
ONE-SIG  15,18.25 0 top
ONE-SIG1  15,18.25 0 bottom
ONE-SIG2  25,18.25 0 top
ONE-SIG3  24,18.25 0 top
ONEHVI  17.75,9.25 0 top
ONEHVI1  17,9.25 0 bottom
ONEHVI2  39.5,9.25 0 top
ONEHVI3  40.5,9.25 0 top
ONEHVO  17,9.25 0 top
ONEHVO1  17.75,9.25 0 bottom
ONEHVO2  25,9.25 0 bottom
ONEHVO3  24,9.25 0 bottom
OTHER  30.68,8.9 90 top
OTHER-SIG  15,19.75 0 top
OTHER-SIG1  15,19.75 0 bottom
OTHER-SIG2  25,19.75 0 top
OTHER-SIG3  24,19.75 0 top
OTHERHVI  17.75,5.75 0 top
OTHERHVI1  17.75,5.75 0 bottom
OTHERHVI2  40.5,5.5 0 top
OTHERHVI3  39.5,5.5 0 top
OTHERHVO  17,5.75 0 top
OTHERHVO1  17,5.75 0 bottom
OTHERHVO2  25,5.75 0 bottom
OTHERHVO3  24,5.75 0 bottom
R1  11.25,20.5 180 bottom
R2  12,18.75 270 bottom
R3  10.75,17 270 bottom
R4  33.25,8.5 270 top
R5  33.25,5.5 270 top
R6  33.25,10 270 top
R7  33.25,7 270 top
R8  28,9 270 top
R9  28,6.5 270 top
R10  6.25,0.75 270 bottom
R11  7.5,6 180 top
R12  7,3.5 180 top
R13  6.5,15 270 top
R14  8.75,15 90 top
R15  10,14.5 180 bottom
R16  1.75,10.75 180 top
RX  1.75,29.25 90 top
THERMISTOR  3,10.75 180 top
TP1  19.75,15.25 0 bottom
TP2  19.75,19.75 0 bottom
TP3  19.75,22.75 0 bottom
TP4  1.75,30.75 90 top
TP5  19.75,13.75 0 bottom
TP6  19.75,18.25 0 bottom
TP7  19.75,21.25 0 bottom
TP8  19.75,5.75 0 bottom
TP9  19.75,9.25 0 bottom
TP10  19.75,25.75 0 bottom
TP11  19.75,24.25 0 bottom
TP12  19.75,27.25 0 bottom
TP13  19.75,16.75 0 bottom
TP14  40.5,27.25 0 bottom
TP15  40.5,25.75 0 bottom
TP16  40.5,24.25 0 bottom
TP17  40.5,22.75 0 bottom
TP18  40.5,21.25 0 bottom
TP19  40.5,19.75 0 bottom
TP20  40.5,18.25 0 bottom
TP21  40.5,16.75 0 bottom
TP22  40.5,15.25 0 bottom
TP23  40.5,13.75 0 bottom
TP24  40.5,9.25 0 bottom
TP25  39.5,5.5 0 bottom
TP26  39.75,27.25 0 bottom
TP27  39.75,25.75 0 bottom
TP28  39.75,24.25 0 bottom
TP29  39.75,22.75 0 bottom
TP30  39.75,21.25 0 bottom
TP31  39.75,19.75 0 bottom
TP32  39.75,18.25 0 bottom
TP33  39.75,16.75 0 bottom
TP34  39.75,15.25 0 bottom
TP35  19.75,27.25 0 top
TP36  19.75,13.75 0 top
TP37  19.75,25.75 0 top
TP38  19.75,9.25 0 top
TP39  19.75,24.25 0 top
TP40  19.75,18.25 0 top
TP41  19.75,21.25 0 top
TP42  19.75,19.75 0 top
TP43  19.75,22.75 0 top
TP44  19.75,16.75 0 top
TP45  19.75,15.25 0 top
TP46  19.75,5.75 0 top
TP47  39.75,13.75 0 bottom
TP48  39.5,9.25 0 bottom
TP49  40.5,5.5 0 bottom
TX  1.75,27.75 90 top
U1  7,28.5 90 top
U$1  [LOGO]  5.5,28.25 0 bottom
U$2  9.25,20.5 90 top
U$3  47,24.75 270 bottom
U$5  11.75,11 270 bottom
U$6  47,7.25 270 bottom
U$7  6.25,12 90 top
U$8  2.5,4.5 90 top
U$9  30.75,19.25 180 top
U$10  2.5,20.5 270 top
U$11  11.25,12.25 270 bottom
U$12  11.25,9.75 90 bottom
VCC  15,15.25 0 top
VCC1  15,15.25 0 bottom
VCC2  25,15.25 0 top
VCC3  24,15.25 0 top
VR1  10.64,3.99 270 top

### Tracks (layer width: path | path; a pad name or v marks a point on that pad's centre or on a via)
0D  (via drill 0.25)  (2 unrouted)
  Top 0.152: U$6.0 44.2,12.95 45.25,14 48.64,14 49.88,15.25 49.88,17.25 51.4,18.77 51.4,21.87 50.9,22.37 50.9,23.63 51.66,24.39 51.66,24.72 51.15,25.23 51.15,26.27 51.91,27.03 51.91,27.33 51.41,27.83 51.41,29.5 50.41,30.5 49.5,30.5 48.75,31.25 45.5,31.25 44.2,29.95 U$3.0
  Bottom 0.152: U$6.0 41.5,13.75 TP23.TP
  other vias: 39.5,13.75 40.5,13.75
0I  (via drill 0.25)
  Top 0.152: v33.75,16 35.12,14.62 U$9.16
  Bottom 0.152: 0O3.TP 0O2.TP 31.5,13.75 v33.75,16
0O  (via drill 0.25)  (1 unrouted)
  other vias: 17,13.75 17.75,13.75
1D  (via drill 0.25)  (2 unrouted)
  Top 0.152: U$6.1 46.7,13.75 48.74,13.75 50.14,15.15 50.14,17.14 51.66,18.66 51.66,21.97 51.15,22.48 51.15,23.52 51.91,24.28 51.91,24.83 51.41,25.33 51.41,26.17 52.17,26.93 52.17,27.43 51.66,27.93 51.66,29.84 50.08,31.42 v50.08,31.17
  Bottom 0.152: v50.08,31.17 49.82,31.42 46.87,31.42 U$3.1 | U$6.1 44.4,12.85 42,15.25 TP22.TP
  other vias: 39.5,15.25 40.5,15.25
1I  (via drill 0.25)
  Top 0.152: U$9.15 33.88,15.09 v32.86,16.11
  Bottom 0.152: 1O3.TP 1O2.TP 32,15.25 v32.86,16.11
1O  (via drill 0.25)  (1 unrouted)
  other vias: 17.75,15.25 17,15.25
2D  (via drill 0.25)  (2 unrouted)
  Top 0.152: U$6.2 50.39,15.04 50.39,17.04 51.91,18.56 51.91,22.08 51.41,22.58 51.41,23.42 52.17,24.18 52.17,24.93 51.66,25.43 51.66,26.07 52.42,26.82 52.42,27.54 51.92,28.04 51.92,30.58 v51.75,30.75
  Bottom 0.152: v51.75,30.75 51.35,30.35 U$3.2 | U$6.2 47.05,14 45.5,14 42.75,16.75 TP21.TP
  other vias: 39.5,16.75 40.5,16.75
2I  (via drill 0.25)
  Bottom 0.152: 2O3.TP 2O2.TP 28.25,16.75 29.25,17.75 30.5,21.25 30.5,23.75 29.38,24.88 U$9.8
  other vias: 26.38,24.88
2O  (via drill 0.25)  (1 unrouted)
  other vias: 17,16.75 17.75,16.75
3D  (via drill 0.25)  (2 unrouted)
  Top 0.152: U$6.3 51.15,12.4 51.15,13.76 50.65,14.26 50.65,16.93 52.17,18.45 52.17,22.18 51.66,22.68 51.66,23.32 52.42,24.07 52.42,25.04 51.92,25.54 51.92,25.96 52.67,26.72 52.67,28 v52.42,28.25
  Bottom 0.152: v52.42,28.25 50.1,28.25 U$3.3 | U$6.3 49.8,12.21 47.76,14.25 45.6,14.25 41.61,18.25 TP20.TP
  other vias: 39.5,18.25 40.5,18.25
3I  (via drill 0.25)
  Top 0.152: U$9.9 26.38,16.12 26.76,16.51 v26.76,17.75
  Bottom 0.152: 3O3.TP 3O2.TP 26.26,18.25 v26.76,17.75
3O  (via drill 0.25)  (1 unrouted)
  other vias: 17.75,18.25 17,18.25
4D  (via drill 0.25)  (1 unrouted)
  Top 0.152: U$6.4 51.4,10.25 51.4,13.87 50.9,14.37 50.9,16.83 52.42,18.35 52.42,22.29 51.92,22.79 51.92,23.21 52.67,23.97 52.67,25.5 v52.42,25.75 | U$3.4 49.08,25.43 49.08,24.75 arc-76 47.5,22.75 arc79 v46,20.75
  Bottom 0.152: v52.42,25.75 50.2,25.75 U$3.4 | 4I3.TP TP19.TP 45,19.75 v46,20.75
  other vias: 39.5,19.75 40.5,19.75
4I  (via drill 0.25)
  Top 0.152: v28.75,18.25 31.38,15.62 U$9.13
  Bottom 0.152: 4O3.TP 4O2.TP 27.25,19.75 v28.75,18.25
4O  (via drill 0.25)  (1 unrouted)
  other vias: 17,19.75 17.75,19.75
5D  (via drill 0.25)  (1 unrouted)
  Top 0.152: U$6.5 50.76,5.85 51.66,6.75 51.66,13.97 51.15,14.47 51.15,16.72 52.67,18.24 52.67,22.75 v52.42,23 | U$3.5 48.98,23.35 48.79,23.16 arc-30 47.28,22.28 arc60 46.42,21.43 46.5,21.35 v46.6,21.35
  Bottom 0.152: v52.42,23 50.15,23 U$3.5 | 5I3.TP TP18.TP 41.5,21.25 42.75,20 44.54,20 45.79,21.26 46.5,21.26 v46.6,21.35
  other vias: 39.5,21.25 40.5,21.25
5I  (via drill 0.25)
  Top 0.152: v29.14,19.11 32.62,15.62 U$9.14
  Bottom 0.152: 5O3.TP 5O2.TP 27,21.25 v29.14,19.11
5O  (via drill 0.25)  (1 unrouted)
  other vias: 17,21.25 17.75,21.25
6D  (via drill 0.25)
  Top 0.152: U$6.6 51.11,3.45 51.91,4.25 51.91,14.08 51.41,14.58 51.41,16.26 v52.42,17.27 | v49.75,19.77 49.8,19.82 U$3.6
  Bottom 0.152: v52.42,17.27 49.92,19.77 v49.75,19.77 | TP29.TP 6I2.TP TP17.TP 43.75,22.75 44.5,22 47.25,22 48.3,20.95 U$3.6
  other vias: 40.5,22.75 39.5,22.75
6I  (via drill 0.25)
  Top 0.152: v29.35,19.88 29.19,19.88 28.05,18.75 28.05,15.45 28.88,14.62 U$9.11
  Bottom 0.152: 6O3.TP 6O2.TP 26.75,22.75 29.35,20.15 v29.35,19.88
6O  (via drill 0.25)  (1 unrouted)
  other vias: 17.75,22.75 17,22.75
7D  (via drill 0.25)
  Top 0.152: U$6.7 48.77,1.08 52,1.08 52.17,1.25 52.17,14.18 51.66,14.69 51.66,15.76 v52.42,16.52 | v49.5,19.02 48.33,19.02 U$3.7 46.85,19.15 45.51,20.49 v45.51,22.75
  Bottom 0.152: v52.42,16.52 49.92,19.02 v49.5,19.02 | TP28.TP 7I3.TP TP16.TP 42.89,24.25 44.39,22.75 v45.51,22.75
  other vias: 39.5,24.25 40.5,24.25
7I  (via drill 0.25)
  Top 0.152: U$9.10 27.62,18.88 29.39,20.64 v29.61,20.64
  Bottom 0.152: 7O3.TP 7O2.TP 26.75,24.25 28.5,22.5 28.5,21.75 v29.61,20.64
7O  (via drill 0.25)  (1 unrouted)
  other vias: 17,24.25 17.75,24.25
8D  (via drill 0.25)  (1 unrouted)
  Top 0.152: U$6.8 46.62,0.83 52.15,0.83 52.42,1.1 52.42,14.29 51.92,14.79 51.92,15.25 v52.42,15.76 | v49.25,18.26 46.69,18.26 U$3.8 45,19.95 45,23.21 v44.71,23.5
  Bottom 0.152: v52.42,15.76 49.92,18.26 v49.25,18.26 | 8I3.TP TP15.TP 41.75,25.75 44,23.5 v44.71,23.5
  other vias: 39.5,25.75 40.5,25.75
8I  (via drill 0.25)
  Top 0.152: v35,26 35,25 U$9.1
  Bottom 0.152: 8O3.TP 8O2.TP 25.5,26.25 34.75,26.25 v35,26
8O  (via drill 0.25)  (1 unrouted)
  other vias: 17.75,25.75 17,25.75
9D  (via drill 0.25)  (1 unrouted)
  Top 0.152: U$6.9 44.2,2.13 45.75,0.58 52.25,0.58 52.67,1 52.67,14.75 v52.42,15 | v49,17.5 46,17.5 44.2,19.3 U$3.9 44.2,24.07 v44.02,24.25
  Bottom 0.152: v52.42,15 49.92,17.5 v49,17.5 | v44.02,24.25 41.02,27.25 TP14.TP 9I3.TP
  other vias: 39.5,27.25 40.5,27.25
9I  (via drill 0.25)
  Top 0.152: v33,27.25 33.88,26.38 U$9.2
  Bottom 0.152: 9O3.TP 9O2.TP v33,27.25
9O  (via drill 0.25)  (1 unrouted)
  other vias: 17,27.25 17.75,27.25
A1  (via drill 0.25)
  Top 0.152: v9.76,24.76 9.5,24.5 6.71,24.5 5.75,25.46 U1.2 | v11.11,23.82 12.11,22.82 14.93,22.82 A3.TP
  Bottom 0.152: v9.76,24.76 9.76,24.74 10.75,23.75 11.04,23.75 v11.11,23.82
  other vias: 15,22.75
A1I
  Top 0.152: A13.TP A9.TP 31.5,22.75 32.62,23.88 U$9.3
A2  (via drill 0.25)
  Top 0.152: A5.TP 14.75,24.25 13.93,25.07 13.75,25.25 10.96,25.25 U1.9
  other vias: 15,24.25
A2I
  Top 0.152: A14.TP A10.TP 25.75,23.5 28.5,23.5 28.88,23.88 U$9.6
A4  (via drill 0.25)
  Top 0.152: U1.10 9.99,27.25 10.3,26.95 13.4,26.95 14.6,25.75 A6.TP
  other vias: 15,25.75
A4I
  Top 0.152: A15.TP A11.TP 25.5,26.25 26.6,26.25 27.62,25.23 U$9.7
A8  (via drill 0.25)
  Top 0.152: U1.11 10.26,27.74 10.75,27.25 A7.TP
  other vias: 15,27.25
A8I
  Top 0.152: A16.TP A12.TP 30,27.25 31.38,25.88 U$9.4
BATT  (via drill 0.25, 0.35)
  Top 0.254: C11.1 R13.1
  Top 0.305: C11.1 4.2,15.05 3.25,16 BATT.TP 2.5,17.5 U$10.P$1 | R13.1 7.65,16.85 8.53,16.85 v10.28,18.6 v10.28,21.4
  Top 0.508: U$8.P$1 3.85,5.9 LT8365.3
  Top 0.813: BATT.TP 1.75,16.75 0.4,15.4 0.4,8.2 2.5,6.1 U$8.P$1
  Bottom 0.152: C7.2 11,22.25 10.18,21.43 LTC3539.4 | LTC3539.5 v10.28,18.6
  Bottom 0.254: LTC3539.5 10.18,18.68 10.5,19 10.5,21.07 LTC3539.4
  Bottom 0.305: LTC4120.09 5.55,14.9 v5.55,15 C11.1 3.25,15.95 BATT.TP | LTC3539.4 v10.28,21.4
  other vias: 4.2,15 4.5,6.55
BUZZ  (via drill 0.25)
  Top 0.152: U1.1 5.25,25.5 7,23.75 10,23.75 11.7,22.05 11.7,18 v11.45,17.75
  Bottom 0.152: R3.1 v11.45,17.75
DEBOUNCE  (via drill 0.25)
  Top 0.152: v4.54,26.67 U1.32
  Bottom 0.152: DBNCE.4 9.05,24.5 6.71,24.5 v4.54,26.67
GND  (via drill 0.25, 0.35)  (1 unrouted)
  Top 0.152: C4.1 5.5,4.75 LT8365.PAD | 6.29,25.29 6.25,25.32 6.25,26.02 U1.3 6.24,26.49 6.45,26.7 7,26.7 7.25,26.44 U1.5
  Top 0.305: v4.25,9.5 3.55,9.5 THERMISTOR.2
  Bottom 0.152: DBNCE.3 7.85,23.93 8.32,23.93 8.75,23.5 8.75,22.5 9.28,21.98 LTC3539.2 | LTC3539.2 LTC3539.3 9.72,20.23 LTC3539.PAD | LTC3539.2 9.28,20.23 LTC3539.PAD | C2.1 C3.1 9.45,19.95 | 9.45,19.95 LTC3539.PAD | LTC3539.7 9.28,19.77 9.45,19.95 | U$12.POS 10.04,10.21 v10.04,10.49
  Bottom 0.254: LT8365.12 5.5,4.25 LT8365.PAD
  Bottom 0.305: LTC4120.05 5.08,10.03 4.55,9.5 v4.25,9.5
  Bottom 0.61: v1.8,8.15 1.4,7.99 v0.38,6.97
  Bottom 0.81: v1,17.5 1,14.75 LGND.TP 1.5,13.25 1,12.75 1,10.75 v4,7.75
  other vias: 9.5,20 12.7,18.75 7.75,17.65 12.7,22.25 10.25,15.2 5.25,4.5 15,12.25
  pour Top: 0,32 0,0 20.5,0 20.5,32
GNDI  (1 unrouted)
  Top 0.254: COM2.TP 25.5,12.25 26,11.75 | U$9.12 30.12,12.31 | 29.75,9.68 29.75,10.5 | ONE.1 30.41,7.34 | OTHER.1 30.6,9.65
  Top 0.508: OTHER.1 29.75,9.68 | 30.41,7.34 30.75,7 | 30.6,9.65 30.75,9.5
  pour Top: 25.5,28 36,28 36,4 25.5,4
  pour Bottom: 25.5,28 36,28 36,4 25.5,4
HV  (via drill 0.25, 0.35)  (2 unrouted)
  Top 0.203: v5.55,1 6,0.55 C8.2
  Top 0.254: HV1.TP 15.25,5.5 15.25,2 13.75,0.5 7.3,0.5 C8.2
  other vias: 15,5.75
HVENA  (via drill 0.25)
  Top 0.152: v10.13,29.25 10.12,29.26 U1.14
  Bottom 0.152: LT8365.1 3.5,7.25 2,8.75 1,8.75 0.25,9.5 0.25,31 0.75,31.5 9.75,31.5 10.13,31.11 v10.13,29.25
HVI  (1 unrouted)
  Top 0.152: HV2.TP 26.5,4.25 32.93,4.25 33.95,5.27 R5.2 R7.2 R4.2 R6.2
N22
  Bottom 0.152: C1.2 R1.2 11.3,19.75 R2.2 11.3,18.55 10.75,18 9.98,18 9.72,18.25 LTC3539.6
N$1  (via drill 0.25)
  Bottom 0.152: BUZZER.6 7.75,16 8.07,16.32 12.57,16.32 U$2.-
  other vias: 13,16.75
N$2  (via drill 0.25)
  Bottom 0.305: LTC3539.1 8.72,21.5 5.5,21.5 5.1,21.9 U$10.P$2
  other vias: 2.5,21.9
N$3  (via drill 0.25)
  other vias: 19.75,5.75
N$4  (via drill 0.25)
  other vias: 19.75,9.25
N$5
  Top 0.152: R4.1 32.2,8.15 OTHER.4
N$6
  Bottom 0.152: R3.2 8.75,17 8.5,17.25 BUZZER.2
N$7  (via drill 0.25)
  Top 0.152: v5.42,6.45 C4.2
  Bottom 0.152: LT8365.5 5.5,6.53 v5.42,6.45
N$8
  Top 0.152: OTHER.5 OTHER.6 31.93,10 R6.1
N$9  (via drill 0.25)
  other vias: 19.75,13.75
N$10
  Top 0.152: C5.2 8.62,6.42 R11.2
N$11  (1 unrouted)
  Top 0.152: R8.2 29.68,9 29.7,8.98 29.78,8.98
N$12  (via drill 0.35)
  Top 0.406: D1.A 1.85,2.45 U$8.P$2 2.5,3.15 v2.4,3.25
  Bottom 0.406: v3.25,3.25 4.05,2.45 LT8365.14 LT8365.16 3.5,3 v3.25,3.25 | v3.25,3.25 v2.4,3.25
N$13  (via drill 0.35)
  Bottom 0.203: R10.1 6.95,2.4 LT8365.9 7.45,2.45 8,3 8,4.15 VR1.1
  other vias: 8.84,4.99
N$14  (via drill 0.25)
  Top 0.152: U$12.NEG 11.75,9.5 C10.1
  Bottom 0.152: U$12.NEG 12.5,10.25 U$5.POS
  other vias: 12,9.75
N$15
  Top 0.152: C9.2 10.55,11.3 | 10.55,11.3 10.55,9.9 10.15,9.5 C10.2 | 11.28,12.03 10.55,11.3
  Top 0.254: LAC.TP 12.75,13.75 12.75,12.18 12.38,11.81 11.49,11.81 11.28,12.03 C9.2
N$16  (via drill 0.35)
  Bottom 0.203: LT8365.8 7.35,6.55 R11.1
  other vias: 7.5,6.7
N$17  (via drill 0.25)
  other vias: 19.75,15.25
N$18  (via drill 0.25)
  Top 0.152: v6.06,3.21 5.64,2.8 C6.2
  Bottom 0.152: LT8365.11 6,3.16 v6.06,3.21
N$19  (via drill 0.35)
  Top 0.203: v7.25,3.42 7,3.17 R12.2
  Bottom 0.203: v7.25,3.42 6.93,3.1 6.77,3.1 6.5,2.84 LT8365.10
N$20  (via drill 0.25)
  other vias: 19.75,16.75
N$21  (via drill 0.25)  (1 unrouted)
  Bottom 0.152: v11.45,11.25 11.2,11 U$5.NEG | U$5.NEG 10.5,11.5 | 10.5,11.5 U$11.NEG | U$5.NEG 9.45,11 LTC4120.16 | LTC4120.16 10.03,11.03 10.5,11.5 | LTC4120.16 9.15,10.75 7.25,10.75 6.92,10.43 LTC4120.03
N$22  (via drill 0.25)  (1 unrouted)
  Top 0.152: v12,12.5 12,12.7 C9.1 11.07,13.63 9.03,13.63 8.53,13.13 8.53,12.6 8.28,12.34 6.21,12.34 v5.82,11.95
  Bottom 0.152: v5.82,11.95 5.35,11.95 LTC4120.06
N$23  (via drill 0.25)
  other vias: 19.75,18.25
N$24  (via drill 0.25)
  other vias: 19.75,19.75
N$25  (via drill 0.25)
  other vias: 19.75,21.25
N$26
  Bottom 0.152: R15.2 9.43,13.22 LTC4120.13
N$27  (via drill 0.25)
  Top 0.152: R14.1 9.2,14.75 v9,14.75
  Bottom 0.152: v9,14.75 7.75,14.75 7.58,14.57 LTC4120.11
N$28  (via drill 0.25)
  Top 0.152: R14.2 R13.2
  Bottom 0.152: R13.2 7.2,14.95 6.92,14.68 LTC4120.10
  other vias: 7.2,15
N$29  (via drill 0.25)
  other vias: 19.75,22.75
N$30  (via drill 0.25)
  Top 0.152: R16.1 THERMISTOR.1 3,11.5 4.1,12.6 8.17,12.6 8.28,12.7 8.28,13.68 v8.53,13.93
  Bottom 0.152: LTC4120.12 8.47,13.93 v8.53,13.93
N$31  (via drill 0.25)
  Top 0.152: U$7.P$1 6.24,13.38 v6.03,13.38
  Bottom 0.152: v6.03,13.38 5.62,12.97 LTC4120.08
N$32  (via drill 0.25)
  Top 0.152: C13.2 6.25,9.45 U$7.P$2
  Top 0.254: v6.25,10.57 U$7.P$2
  Bottom 0.254: LTC4120.04 6.25,9.85 v6.25,10.57
N$33  (via drill 0.25)
  Top 0.152: C13.1 v7.2,8.98
  Bottom 0.152: v7.2,8.98 7.58,9.36 LTC4120.02
N$34  (via drill 0.25)
  Top 0.152: R16.2 2.45,10.75 3.5,10.75 3.75,11 3.75,11.25 v4,11.5 | C14.1 9.6,12.9 8.1,11.4 | v4,11.5 v4.01,11.49 | v4,11.5 4.1,11.4 8.1,11.4 | 8.1,11.4 8.17,11.4 8.39,11.19 v8.39,9.66
  Bottom 0.152: v4,11.5 4.83,12.32 LTC4120.07 | LTC4120.01 v8.39,9.66
N$35  (via drill 0.25)
  other vias: 19.75,24.25
N$36  (via drill 0.25)
  other vias: 19.75,25.75
N$37  (via drill 0.25)
  other vias: 19.75,27.25
N$38  (1 unrouted)
  Top 0.152: R9.2 28.87,6.67 29.78,6.67
N$39
  cutout Top: 15.6,28 15.6,4 arc180 16.4,4 16.4,28 arc180
N$40
  cutout Bottom: 15.6,28 15.6,4 arc180 16.4,4 16.4,28 arc180
N$41
  Top 0.152: R5.1 31.92,5.5 ONE.4
N$42
  Top 0.152: ONE.5 ONE.6 32.21,7.34 R7.1
N$43
  cutout Top: 18.35,28 18.35,4 arc180 19.15,4 19.15,28 arc180
N$44
  cutout Bottom: 18.35,28 18.35,4 arc180 19.15,4 19.15,28 arc180
N$45
  cutout Top: 5,8.25 10.5,8.25 arc-46 10.85,8.1 arc-3 12.75,6.2 arc3 12.8,6.15 arc-183 12.1,5.45 arc3 11.6,5.95 arc-3 10.5,7.05 arc49 10,7.25 5,7.25 arc-180
N$46
  cutout Bottom: 5,8.25 10.5,8.25 arc-46 10.85,8.1 arc-3 12.75,6.2 arc3 12.8,6.15 arc-183 12.1,5.45 arc3 11.6,5.95 arc-3 10.5,7.05 arc49 10,7.25 5,7.25 arc-180
ONE  (via drill 0.25)
  Top 0.152: U1.13 9.91,28.75 9.93,28.74 11.26,28.74 v11.5,28.5
  Bottom 0.152: ONE-SIG1.TP 14.01,19.24 14.01,25.44 11.6,27.85 11.6,28.4 v11.5,28.5
  other vias: 15,18.25
ONEHVD  (via drill 0.25)  (1 unrouted)
  Top 0.152: TP48.TP 39.5,9.19 | U$3.A 43.11,25.06 43.11,11.86 TP24.TP
  other vias: 39.5,9.25 40.5,9.25
ONEHVI  (via drill 0.25)
  Top 0.152: ONE.3 29.78,5.59 29.44,5.25 26.75,5.25 26.25,5.75 26.25,8 ONEHVO2.TP
  Bottom 0.152: ONEHVO2.TP ONEHVO3.TP
  other vias: 25,9.25
ONEHVO  (via drill 0.25)  (1 unrouted)
  other vias: 17,9.25 17.75,9.25
ONEI  (via drill 0.25)
  Top 0.152: ONE-SIG3.TP ONE-SIG2.TP 25.5,18.25 29.25,22 33.22,22 34.01,21.21 v34.01,18.42 | v30.75,11.24 30.5,11.5 28.86,11.5 27.78,10.42 27.78,6.98 R9.1
  Bottom 0.152: v34.01,18.42 34.5,17.93 34.5,13 33.65,12.15 31.66,12.15 v30.75,11.24
OTHER  (via drill 0.25)
  Top 0.152: U1.12 10.68,28.25 v10.84,28.09 | v13.9,18.6 13.9,19.35 14.3,19.75 OTHER-SIG1.TP
  Bottom 0.152: v10.84,28.09 10.91,28.09 13.75,25.25 13.75,24 13.75,18.75 v13.9,18.6
  other vias: 15,19.75
OTHERHVD  (via drill 0.25)  (1 unrouted)
  Top 0.152: TP49.TP 43.65,8.65 U$6.A
  other vias: 39.5,5.5 40.5,5.5
OTHERHVI  (via drill 0.25)
  Top 0.152: OTHER.3 29.4,8.15 29,7.75 v28.75,7.75
  Bottom 0.152: v28.75,7.75 28.5,8 26.75,8 25,6.25 25.5,6.25 OTHERHVO2.TP OTHERHVO3.TP
OTHERHVO  (via drill 0.25)  (2 unrouted)
  other vias: 17.75,5.75 17,5.75
OTHERI  (via drill 0.25)
  Top 0.152: OTHER-SIG3.TP OTHER-SIG2.TP 25.25,19.75 27.75,22.25 33.5,22.25 34.75,21 v34.75,18.75 | v31.75,11.5 31.5,11.75 28.75,11.75 27.3,10.3 R8.1
  Bottom 0.152: v34.75,18.75 34.75,12.75 33.75,11.75 32,11.75 v31.75,11.5
RX
  Top 0.152: RX.TP 2,29.25 3.51,27.74 U1.30
TX
  Top 0.152: TX.TP 2.25,27.25 U1.31
VCC  (via drill 0.25)
  Top 0.152: U1.4 6.75,25.73 7.03,25.45 7.48,25.45 7.75,25.72 | 7.75,25.72 7.76,25.73 U1.6 | U1.18 8.24,31.27 8.53,31.55 8.99,31.55 v9.54,30.99 | v7.75,25.3 7.75,25.72
  other vias: 5.5,16.75 15,15.25
  pour Bottom: 0,0 20.5,0 20.5,32 0,32
VCCI  (via drill 0.25)  (1 unrouted)
  Top 0.152: U$9.5 30.12,23.88 v29.75,23.5 | VCC2.TP 26.25,16.5 26.25,18.05 29.6,21.4 v29.95,21.4
  Bottom 0.152: v29.75,23.5 29.75,22.75 30,22.5 30,21.45 v29.95,21.4